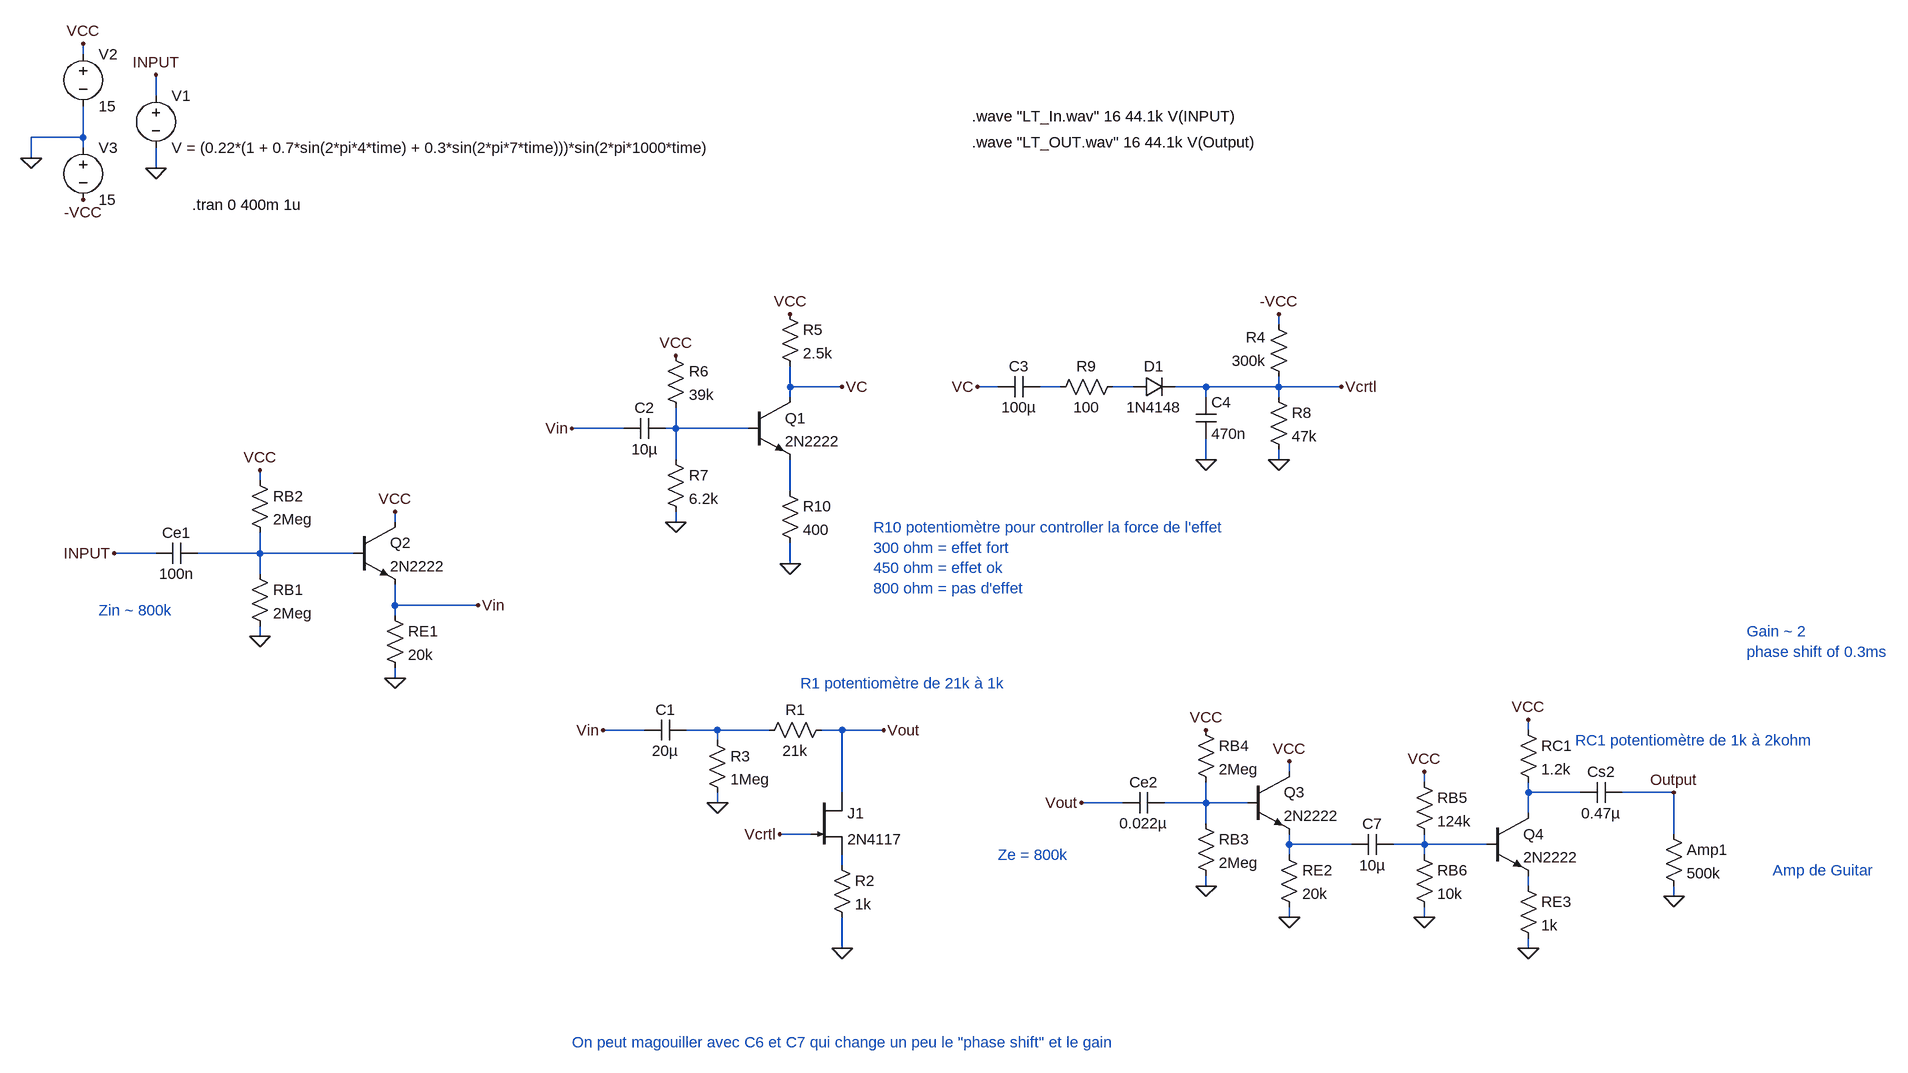
[diagram p0: schematic Circuit_complet_avec_Adaptation.asc]
Circuit_complet_avec_Adaptation.asc, the LTspice schematic file:
Version 4
SHEET 1 2212 1264
WIRE -1440 -816 -1440 -832
WIRE -1328 -752 -1328 -784
WIRE -1440 -688 -1440 -736
WIRE -1440 -688 -1520 -688
WIRE -1440 -672 -1440 -688
WIRE -1520 -656 -1520 -688
WIRE -1328 -640 -1328 -672
WIRE 400 -400 400 -416
WIRE -352 -304 -352 -336
WIRE -272 -304 -352 -304
WIRE -32 -304 -64 -304
WIRE 64 -304 32 -304
WIRE 176 -304 144 -304
WIRE 288 -304 240 -304
WIRE 400 -304 400 -320
WIRE 400 -304 288 -304
WIRE 496 -304 400 -304
WIRE -352 -288 -352 -304
WIRE 288 -288 288 -304
WIRE 400 -288 400 -304
WIRE -608 -240 -688 -240
WIRE -528 -240 -528 -272
WIRE -528 -240 -544 -240
WIRE -416 -240 -528 -240
WIRE -528 -192 -528 -240
WIRE 288 -192 288 -224
WIRE 400 -192 400 -208
WIRE -1168 -160 -1168 -176
WIRE -352 -144 -352 -192
WIRE -960 -96 -960 -112
WIRE -528 -96 -528 -112
WIRE -1328 -48 -1392 -48
WIRE -1168 -48 -1168 -80
WIRE -1168 -48 -1264 -48
WIRE -1024 -48 -1168 -48
WIRE -352 -32 -352 -64
WIRE -1168 -16 -1168 -48
WIRE -960 32 -960 0
WIRE -832 32 -960 32
WIRE -960 48 -960 32
WIRE -1168 80 -1168 64
WIRE -960 144 -960 128
WIRE -576 224 -640 224
WIRE -464 224 -512 224
WIRE -384 224 -464 224
WIRE -272 224 -304 224
WIRE -208 224 -272 224
WIRE 784 224 784 208
WIRE -464 240 -464 224
WIRE 416 288 416 272
WIRE 624 304 624 288
WIRE -272 320 -272 224
WIRE 784 320 784 304
WIRE 864 320 784 320
WIRE 1008 320 928 320
WIRE -464 336 -464 320
WIRE 160 336 96 336
WIRE 288 336 288 304
WIRE 288 336 224 336
WIRE 352 336 288 336
WIRE 784 352 784 320
WIRE 288 368 288 336
WIRE -320 384 -368 384
WIRE 1008 384 1008 320
WIRE 416 400 416 384
WIRE 512 400 416 400
WIRE 624 400 624 384
WIRE 624 400 576 400
WIRE 720 400 624 400
WIRE 416 416 416 400
WIRE 624 416 624 400
WIRE -272 432 -272 416
WIRE 288 464 288 448
WIRE 784 464 784 448
WIRE 1008 480 1008 464
WIRE 416 512 416 496
WIRE 624 512 624 496
WIRE -272 560 -272 512
WIRE 784 560 784 544
FLAG -1328 -640 0
FLAG -1328 -784 INPUT
FLAG -208 224 Vout
FLAG -272 560 0
FLAG -464 336 0
FLAG -352 -32 0
FLAG -528 -96 0
FLAG -528 -352 VCC
FLAG -352 -416 VCC
FLAG -1440 -832 VCC
FLAG 288 -192 0
FLAG 496 -304 Vcrtl
FLAG -1520 -656 0
FLAG -1440 -592 -VCC
FLAG 400 -192 0
FLAG 400 -416 -VCC
FLAG -368 384 Vcrtl
FLAG -1168 80 0
FLAG -1168 -176 VCC
FLAG -960 -112 VCC
FLAG -1392 -48 INPUT
FLAG -688 -240 Vin
FLAG -640 224 Vin
FLAG 288 464 0
FLAG 288 224 VCC
FLAG 416 272 VCC
FLAG 1008 320 Output
FLAG 96 336 Vout
FLAG 1008 480 0
FLAG -832 32 Vin
FLAG -960 144 0
FLAG 416 512 0
FLAG 624 288 VCC
FLAG 784 208 VCC
FLAG 624 512 0
FLAG 784 560 0
FLAG -64 -304 VC
FLAG -272 -304 VC
SYMBOL voltage -1328 -768 R0
SYMATTR InstName V1
SYMATTR Value V = (0.22*(1 + 0.7*sin(2*pi*4*time) + 0.3*sin(2*pi*7*time)))*sin(2*pi*1000*time)
SYMATTR Prefix B
SYMBOL njf -320 320 R0
SYMATTR InstName J1
SYMATTR Value 2N4117
SYMBOL res -288 208 R90
WINDOW 0 0 56 VBottom 2
WINDOW 3 32 56 VTop 2
SYMATTR InstName R1
SYMATTR Value 21k
SYMBOL cap -512 208 R90
WINDOW 0 0 32 VBottom 2
WINDOW 3 32 32 VTop 2
SYMATTR InstName C1
SYMATTR Value 20µ
SYMBOL res -288 416 R0
SYMATTR InstName R2
SYMATTR Value 1k
SYMBOL res -480 224 R0
SYMATTR InstName R3
SYMATTR Value 1Meg
SYMBOL res 416 -304 R180
WINDOW 0 36 76 Left 2
WINDOW 3 36 40 Left 2
SYMATTR InstName R4
SYMATTR Value 300k
SYMBOL npn -416 -288 R0
SYMATTR InstName Q1
SYMATTR Value 2N2222
SYMBOL res -368 -432 R0
SYMATTR InstName R5
SYMATTR Value 2.5k
SYMBOL res -544 -368 R0
SYMATTR InstName R6
SYMATTR Value 39k
SYMBOL res -544 -208 R0
SYMATTR InstName R7
SYMATTR Value 6.2k
SYMBOL voltage -1440 -832 R0
WINDOW 123 0 0 Left 0
WINDOW 39 0 0 Left 0
SYMATTR InstName V2
SYMATTR Value 15
SYMBOL cap -544 -256 R90
WINDOW 0 0 32 VBottom 2
WINDOW 3 32 32 VTop 2
SYMATTR InstName C2
SYMATTR Value 10µ
SYMBOL cap 32 -320 R90
WINDOW 0 0 32 VBottom 2
WINDOW 3 32 32 VTop 2
SYMATTR InstName C3
SYMATTR Value 100µ
SYMBOL diode 176 -288 R270
WINDOW 0 32 32 VTop 2
WINDOW 3 0 32 VBottom 2
SYMATTR InstName D1
SYMATTR Value 1N4148
SYMBOL cap 272 -288 R0
SYMATTR InstName C4
SYMATTR Value 470n
SYMBOL voltage -1440 -688 R0
WINDOW 123 0 0 Left 0
WINDOW 39 0 0 Left 0
SYMATTR InstName V3
SYMATTR Value 15
SYMBOL res 384 -304 R0
SYMATTR InstName R8
SYMATTR Value 47k
SYMBOL res 160 -320 R90
WINDOW 0 0 56 VBottom 2
WINDOW 3 32 56 VTop 2
SYMATTR InstName R9
SYMATTR Value 100
SYMBOL res -368 -160 R0
SYMATTR InstName R10
SYMATTR Value 400
SYMBOL res -1184 -32 R0
SYMATTR InstName RB1
SYMATTR Value 2Meg
SYMBOL res -1184 -176 R0
SYMATTR InstName RB2
SYMATTR Value 2Meg
SYMBOL res -976 32 R0
SYMATTR InstName RE1
SYMATTR Value 20k
SYMBOL npn -1024 -96 R0
SYMATTR InstName Q2
SYMATTR Value 2N2222
SYMBOL cap -1264 -64 R90
WINDOW 0 0 32 VBottom 2
WINDOW 3 32 32 VTop 2
SYMATTR InstName Ce1
SYMATTR Value 100n
SYMBOL res 272 352 R0
SYMATTR InstName RB3
SYMATTR Value 2Meg
SYMBOL res 272 208 R0
SYMATTR InstName RB4
SYMATTR Value 2Meg
SYMBOL res 400 400 R0
SYMATTR InstName RE2
SYMATTR Value 20k
SYMBOL npn 352 288 R0
SYMATTR InstName Q3
SYMATTR Value 2N2222
SYMBOL cap 224 320 R90
WINDOW 0 0 32 VBottom 2
WINDOW 3 32 32 VTop 2
SYMATTR InstName Ce2
SYMATTR Value 0.022µ
SYMBOL res 608 288 R0
SYMATTR InstName RB5
SYMATTR Value 124k
SYMBOL res 608 400 R0
SYMATTR InstName RB6
SYMATTR Value 10k
SYMBOL res 768 448 R0
SYMATTR InstName RE3
SYMATTR Value 1k
SYMBOL res 768 208 R0
SYMATTR InstName RC1
SYMATTR Value 1.2k
SYMBOL npn 720 352 R0
SYMATTR InstName Q4
SYMATTR Value 2N2222
SYMBOL cap 928 304 R90
WINDOW 0 0 32 VBottom 2
WINDOW 3 32 32 VTop 2
SYMATTR InstName Cs2
SYMATTR Value 0.47µ
SYMBOL res 992 368 R0
SYMATTR InstName Amp1
SYMATTR Value 500k
SYMBOL cap 576 384 R90
WINDOW 0 0 32 VBottom 2
WINDOW 3 32 32 VTop 2
SYMATTR InstName C7
SYMATTR Value 10µ
TEXT -1272 -584 Left 2 !.tran 0 400m 1u
TEXT -1416 40 Left 2 ;Zin ~ 800k
TEXT 1160 440 Left 2 ;Amp de Guitar
TEXT 1120 72 Left 2 ;Gain ~ 2\nphase shift of 0.3ms
TEXT -32 416 Left 2 ;Ze = 800k
TEXT -688 704 Left 2 ;On peut magouiller avec C6 et C7 qui change un peu le "phase shift" et le gain
TEXT -224 -88 Left 2 ;R10 potentiomètre pour controller la force de l'effet\n300 ohm = effet fort\n450 ohm = effet ok\n800 ohm = pas d'effet
TEXT -72 -720 Left 2 !.wave "LT_In.wav" 16 44.1k V(INPUT)
TEXT -72 -680 Left 2 !.wave "LT_OUT.wav" 16 44.1k V(Output)
TEXT 856 240 Left 2 ;RC1 potentiomètre de 1k à 2kohm
TEXT -336 152 Left 2 ;R1 potentiomètre de 21k à 1k

The netlist it stands for:
* Circuit_complet_avec_Adaptation.asc
B§V1 INPUT 0 V = (0.22*(1 + 0.7*sin(2*pi*4*time) + 0.3*sin(2*pi*7*time)))*sin(2*pi*1000*time)
J1 Vout Vcrtl N011 2N4117
R1 Vout N006 21k
C1 N006 Vin 20µ
R2 N011 0 1k
R3 N006 0 1Meg
R4 Vcrtl -VCC 300k
Q1 VC N003 N004 0 2N2222
R5 VCC VC 2.5k
R6 VCC N003 39k
R7 N003 0 6.2k
V2 VCC 0 15
C2 N003 Vin 10µ
C3 N001 VC 100µ
D1 N002 Vcrtl 1N4148
C4 Vcrtl 0 470n
V3 0 -VCC 15
R8 Vcrtl 0 47k
R9 N002 N001 100
R10 N004 0 400
RB1 N005 0 2Meg
RB2 VCC N005 2Meg
RE1 Vin 0 20k
Q2 VCC N005 Vin 0 2N2222
Ce1 N005 INPUT 100n
RB3 N008 0 2Meg
RB4 VCC N008 2Meg
RE2 N009 0 20k
Q3 VCC N008 N009 0 2N2222
Ce2 N008 Vout 0.022µ
RB5 VCC N010 124k
RB6 N010 0 10k
RE3 N012 0 1k
RC1 VCC N007 1.2k
Q4 N007 N010 N012 0 2N2222
Cs2 Output N007 0.47µ
R§Amp1 Output 0 500k
C7 N010 N009 10µ
.model D D
.lib standard.dio
.model NPN NPN
.model PNP PNP
.lib standard.bjt
.model NJF NJF
.model PJF PJF
.lib standard.jft
.tran 0 400m 1u
* Zin ~ 800k
* Amp de Guitar
* Gain ~ 2
* phase shift of 0.3ms
* Ze = 800k
* On peut magouiller avec C6 et C7 qui change un peu le "phase shift" et le gain
* R10 potentiomètre pour controller la force de l'effet
* 300 ohm = effet fort
* 450 ohm = effet ok
* 800 ohm = pas d'effet
.wave "LT_In.wav" 16 44.1k V(INPUT)
.wave "LT_OUT.wav" 16 44.1k V(Output)
* RC1 potentiomètre de 1k à 2kohm
* R1 potentiomètre de 21k à 1k
.backanno
.end